# Altium schematic sheet Power.SchDoc
size A4; SheetNumber: 3; SheetTotal: 5
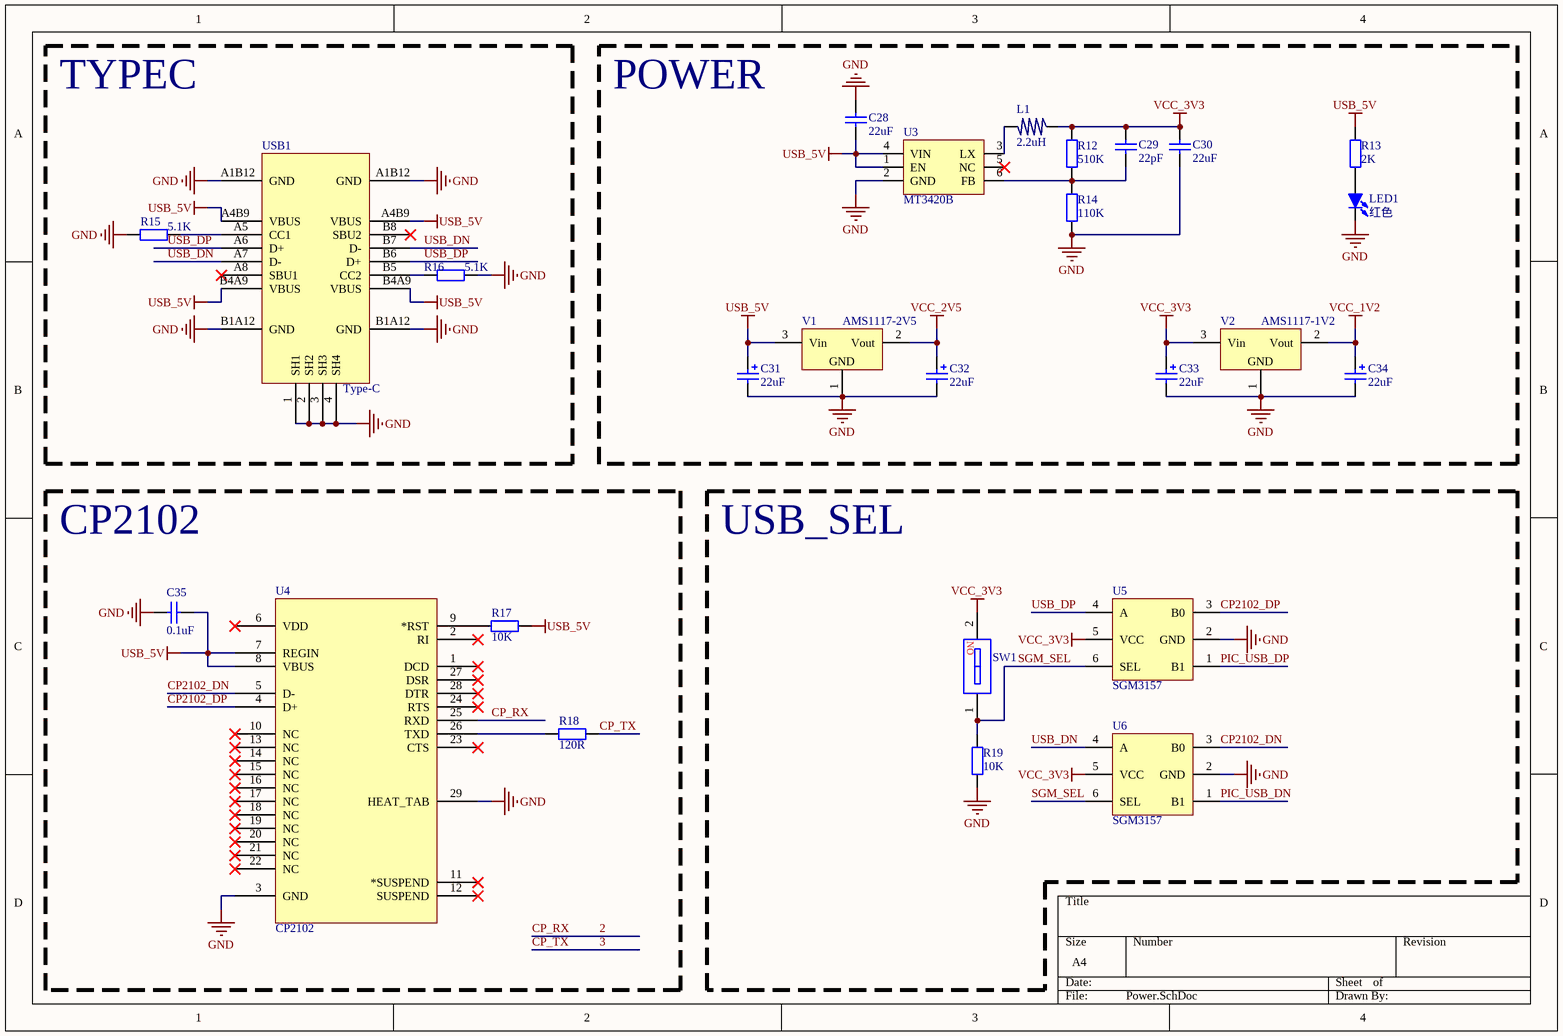
[diagram p0: Power.SchDoc]

## Parts
C28  22uF  [0603_C _MINI]
C29  22pF  [0402_C]
C30  22uF  [0603_C _MINI]
C31  22uF  [CASE-A_3216]
C32  22uF  [CASE-A_3216]
C33  22uF  [CASE-A_3216]
C34  22uF  [CASE-A_3216]
C35  0.1uF  [0402_C]
L1  2.2uH  [NR3015]
LED1  红色  [LED 0603R]
R12  510K  [0402_R]
R13  2K  [0402_R]
R14  110K  [0402_R]
R15  5.1K  [0402_R]
R16  5.1K  [0402_R]
R17  10K  [0402_R]
R18  120R  [0402_R]
R19  10K  [0402_R]
SW1  CSW-1P  [SW-SMD_DSIC01LSGET]  (value not drawn)
U3  MT3420B  [SOT23-6L]
U4  CP2102  [QFN28 5x5_N]
U5  SGM3157  [SC-70-6_L2.2-W1.3-P0.65-LS2.2-BR]
U6  SGM3157  [SC-70-6_L2.2-W1.3-P0.65-LS2.2-BR]
USB1  Type-C  [Type-C-TOP]
V1  AMS1117-2V5  [SOT89_N]
V2  AMS1117-1V2  [SOT89_N]

## Blocks framed on the sheet
TYPEC: R15 R16 USB1
POWER: C28-C34 L1 LED1 R12-R14 U3 V1 V2
CP2102: C35 R17 R18 U4
USB_SEL: R19 SW1 U5 U6

## Nets
GND: C28.2 C30.1 C31.2 C32.2 C33.2 C34.2 C35.2 LED1.2(K) R14.1 R15.1 R16.2 R19.1 U3.2(GND) U4.3(GND) U4.29(HEAT_TAB) U5.2(GND) U6.2(GND) USB1.1(SH1) USB1.2(SH2) USB1.3(SH3) USB1.4(SH4) USB1.A1B12(GND) USB1.B1A12(GND) V1.1(GND) V2.1(GND)
USB_5V: C28.1 C31.1 C35.1 R13.2 R17.2 U3.1(EN) U3.4(VIN) U4.7(REGIN) U4.8(VBUS) USB1.A4B9(VBUS) USB1.B4A9(VBUS) V1.3(Vin)
VCC_1V2: C34.1 V2.2(Vout)
VCC_2V5: C32.1 V1.2(Vout)
VCC_3V3: C29.2 C30.2 C33.1 L1.1 R12.2 SW1.2 U5.5(VCC) U6.5(VCC) V2.3(Vin)
2: U4.25(RXD)  [also labelled CP_RX]
3: R18.2  [also labelled CP_TX]
CP2102_DN: U4.5(D-) U6.3(B0)
CP2102_DP: U4.4(D+) U5.3(B0)
PIC_USB_DN: U6.1(B1)
PIC_USB_DP: U5.1(B1)
SGM_SEL: R19.2 SW1.1 U5.6(SEL) U6.6(SEL)
USB_DN: U6.4(A) USB1.A7(D-) USB1.B7(D-)
USB_DP: U5.4(A) USB1.A6(D+) USB1.B6(D+)
NetC29_1: C29.1 R12.1 R14.2 U3.6(FB)
NetL1_2: L1.2 U3.3(LX)
NetLED1_1: LED1.1(A) R13.1
NetR15_2: R15.2 USB1.A5(CC1)
NetR16_1: R16.1 USB1.B5(CC2)
NetR17_1: R17.1 U4.9(*RST)
NetR18_1: R18.1 U4.26(TXD)

Not connected (* = marked no-connect by the designer): U3 5(NC)*; U4 1(DCD)* 2(RI)* 6(VDD)* 10(NC)* 11(*SUSPEND)* 12(SUSPEND)* 13(NC)* 14(NC)* 15(NC)* 16(NC)* 17(NC)* 18(NC)* 19(NC)* 20(NC)* 21(NC)* 22(NC)* 23(CTS)* 24(RTS)* 27(DSR)* 28(DTR)*; USB1 A8(SBU1)* B8(SBU2)*

## Notes on the sheet
- (in symbol CSW-1P) NO

## Library data of the parts
C28 C30 = 0603_C_MINI: 贴片电容; ComponentLink1Description: 供应商链接; ComponentLink1URL: http://www.szlcsc.com/product/details_2037.html; Package: 0603; Supplier: LC; SuppliersPartNumber: C1685
C29 C35 = 0402_C: 贴片电容; ComponentLink1Description: 供应商链接; ComponentLink1URL: http://www.szlcsc.com/product/details_1928.html; Package: 0402; Supplier: LC; SuppliersPartNumber: C1576
C31-C34 = 3216_C: 贴片钽电容; ComponentLink1Description: 供应商链接; ComponentLink1URL: http://www.szlcsc.com/product/details_16815.html; Package: 3528; Supplier: LC; SuppliersPartNumber: C16133
L1 = L
LED1 = 0603_LED_R: 贴片LED; 版权归属: 源创客; BOM名称: 贴片LED; 学习资源: www.ooocke.com
R12-R19 = 0402_R: 贴片电阻; ComponentLink1Description: 供应商链接; ComponentLink1URL: http://www.szlcsc.com/product/details_26667.html; Package: 0402; Supplier: LC; SuppliersPartNumber: C25924
SW1 = CSW-1P: 1路编码开关; 版权归属: 源创客; BOM名称: 1路编码开关; 学习资源: www.ooocke.com
U3 = MT3420B: DCDC
U4 = CP2102: USB转TTL; PART DESC: SINGLE-CHIP USB TO UART BRIDGE, QFN28, RoHS.; MFG #1: SILICON LABS; PART NUMBER: CP2102; Value: Value; RefDes: RefDes; Type: DEV
U5 U6 = SGM3157: 模拟开关
USB1 = USB-Type-C-TOP
V1 V2 = AMS1117: 三端稳压芯片; BOM名称: 稳压芯片; 版权归属: 源创客; 学习资源: www.ooocke.com